# Altium project PCB_Project1.PrjPCB
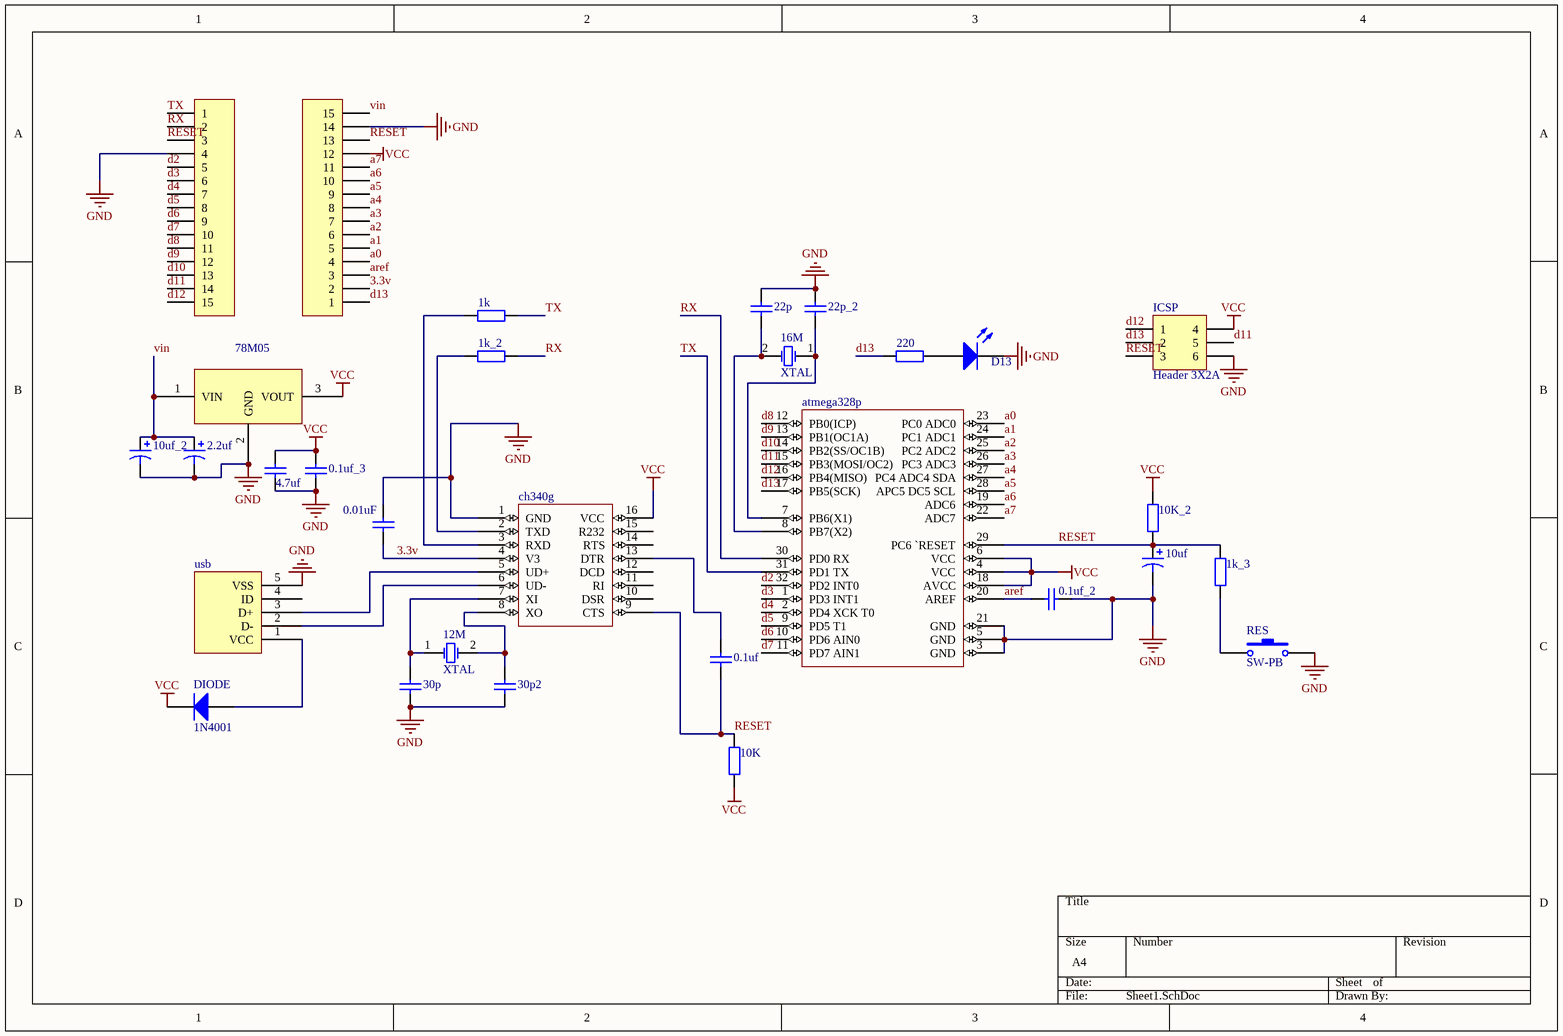
[diagram p0: Sheet1.SchDoc]
1 sheet, 30 parts. Net scope: global (net labels, ports and power ports of the same name join across sheets).
Board files: PCB1.PcbDoc, 拼板.PcbDoc

## Sheet Sheet1.SchDoc
size A4

### Parts
0.01uf  value 0.01uF  [C-RAD-0805]  (hidden comment: Cap)
0.1uf  Cap  [C-RAD-0805]  (value not drawn)
0.1uf_2  Cap  [C-RAD-0805]  (value not drawn)
0.1uf_3  Cap  [C-RAD-0805]  (value not drawn)
1k  Res2  [0805-2]  (value not drawn)
1k_2  Res2  [0805-2]  (value not drawn)
1k_3  Res2  [0805-2]  (value not drawn)
2.2uf  Cap Pol1  [C-RAD-0805]  (value not drawn)
4.7uf  Cap  [C-RAD-0805]  (value not drawn)
10K  Res2  [0805-2]  (value not drawn)
10K_2  Res2  [0805-2]  (value not drawn)
10uf  Cap Pol1  [C-RAD-0805]  (value not drawn)
10uf_2  Cap Pol1  [C-RAD-0805]  (value not drawn)
12M  XTAL  [XTAL]
16M  XTAL  [XTAL]
22p  Cap  [C-RAD-0805]  (value not drawn)
22p_2  Cap  [C-RAD-0805]  (value not drawn)
30p  Cap  [C-RAD-0805]  (value not drawn)
30p2  Cap  [C-RAD-0805]  (value not drawn)
220  Res2  [0805-2]  (value not drawn)
?  78M05  [TO-252]
atmega328p  atmega328p  [TQFP32]  (value not drawn)
ch340g  ch340g  [sop16(2003)]  (value not drawn)
D13  LED0  [LED_0805]  (value not drawn)
DIODE  Type: 1N4001  [DIODE-1206]  (hidden comment: Diode)
ICSP  Header 3X2A  [HDR2X3_CEN]
P1  Header 15  [HDR1X15]  (value not drawn)
P2  Header 15  [HDR1X15]  (value not drawn)
RES  SW-PB  [SW_PB2_A1]
usb  USB_M  [USB_MICRO]  (value not drawn)

### Nets
GND: 0.01uf.1 0.1uf_2.1 0.1uf_3.2 2.2uf.2 4.7uf.2 10uf.2 10uf_2.2 22p.2 22p_2.2 30p.1 30p2.1 ?.2(GND) atmega328p.3(GND) atmega328p.5(GND) atmega328p.21(GND) ch340g.1(GND) D13.2(K) ICSP.6 P1.4 P2.14 RES.2 usb.5(VSS)
VCC: 0.1uf_3.1 4.7uf.1 10K.1 10K_2.2 ?.3(VOUT) atmega328p.4(VCC) atmega328p.6(VCC) atmega328p.18(AVCC) ch340g.16(VCC) DIODE.2(K) ICSP.4 P2.12
3.3v: 0.01uf.2 ch340g.4(V3) P2.2
a0: atmega328p.23(PC0_ADC0) P2.4
a1: atmega328p.24(PC1_ADC1) P2.5
a2: atmega328p.25(PC2_ADC2) P2.6
a3: atmega328p.26(PC3_ADC3) P2.7
a4: atmega328p.27(PC4_ADC4_SDA) P2.8
a5: atmega328p.28(APC5_DC5_SCL) P2.9
a6: atmega328p.19(ADC6) P2.10
a7: atmega328p.22(ADC7) P2.11
aref: 0.1uf_2.2 atmega328p.20(AREF) P2.3
d2: atmega328p.32(PD2_INT0) P1.5
d3: atmega328p.1(PD3_INT1) P1.6
d4: atmega328p.2(PD4_XCK_T0) P1.7
d5: atmega328p.9(PD5_T1) P1.8
d6: atmega328p.10(PD6_AIN0) P1.9
d7: atmega328p.11(PD7_AIN1) P1.10
d8: atmega328p.12(PB0(ICP)) P1.11
d9: atmega328p.13(PB1(OC1A)) P1.12
d10: atmega328p.14(PB2(SS/OC1B)) P1.13
d11: atmega328p.15(PB3(MOSI/OC2)) ICSP.5 P1.14
d12: atmega328p.16(PB4(MISO)) ICSP.1 P1.15
d13: 220.2 atmega328p.17(PB5(SCK)) ICSP.2 P2.1
RESET: 0.1uf.1 1k_3.2 10K.2 10K_2.1 10uf.1 atmega328p.29(PC6_`RESET) ch340g.9(CTS) ICSP.3 P1.3 P2.13
RX: 1k_2.2 atmega328p.30(PD0_RX) P1.2
TX: 1k.2 atmega328p.31(PD1_TX) P1.1
vin: 2.2uf.1 10uf_2.1 ?.1(VIN) P2.15
Net0.1uf_2: 0.1uf.2 ch340g.13(DTR)
Net1k_1: 1k.1 ch340g.3(RXD)
Net1k_2_1: 1k_2.1 ch340g.2(TXD)
Net1k_3_1: 1k_3.1 RES.1
Net12M_1: 12M.1 30p.2 ch340g.7(XI)
Net12M_2: 12M.2 30p2.2 ch340g.8(XO)
Net16M_1: 16M.1 22p_2.1 atmega328p.7(PB6(X1))
Net16M_2: 16M.2 22p.1 atmega328p.8(PB7(X2))
Net220_1: 220.1 D13.1(A)
Netch340g_5: ch340g.5(UD+) usb.3(D+)
Netch340g_6: ch340g.6(UD-) usb.2(D-)
NetDIODE_1: DIODE.1(A) usb.1(VCC)

Not connected (* = marked no-connect by the designer): ch340g 10(DSR) 11(RI) 12(DCD) 14(RTS) 15(R232); usb 4(ID)

### Library data of the parts
0.01uf = Cap: Capacitor; Published: 8-Jun-2000; LatestRevisionDate: 17-Jul-2002; LatestRevisionNote: Re-released for DXP Platform.; PackageReference: RAD-0.3; Publisher: Altium Limited; PackageDescription: Radial Cap, Thru-Hole; 2 Leads; 0.3 in Pin Spacing
0.1uf 0.1uf_2 0.1uf_3 4.7uf = Cap: Capacitor; Value: 0.1uF; Published: 8-Jun-2000; LatestRevisionDate: 17-Jul-2002; LatestRevisionNote: Re-released for DXP Platform.; PackageReference: RAD-0.3; Publisher: Altium Limited; PackageDescription: Radial Cap, Thru-Hole; 2 Leads; 0.3 in Pin Spacing
1k 1k_2 = Res2: Resistor; Value: 1K; Published: 8-Jun-2000; LatestRevisionDate: 17-Jul-2002; LatestRevisionNote: Re-released for DXP Platform.; PackageReference: AXIAL-0.4; Publisher: Altium Limited; PackageDescription: Axial Device, Thru-Hole; 2 Leads; 0.4 in Pin Spacing
1k_3 10K 10K_2 220 = Res2: Resistor; Value: 10K; Published: 8-Jun-2000; LatestRevisionDate: 17-Jul-2002; LatestRevisionNote: Re-released for DXP Platform.; PackageReference: AXIAL-0.4; Publisher: Altium Limited; PackageDescription: Axial Device, Thru-Hole; 2 Leads; 0.4 in Pin Spacing
2.2uf 10uf_2 = Cap Pol1: Polarized Capacitor (Radial); Value: 10uF; Published: 8-Jun-2000; LatestRevisionDate: 17-Jul-2002; LatestRevisionNote: Re-released for DXP Platform.; PackageReference: RB7.6-15; Publisher: Altium Limited; PackageDescription: Polarized Capacitor (Radial); 2 Leads
10uf = Cap Pol1: Polarized Capacitor (Radial); Value: 1uF; Published: 8-Jun-2000; LatestRevisionDate: 17-Jul-2002; LatestRevisionNote: Re-released for DXP Platform.; PackageReference: RB7.6-15; Publisher: Altium Limited; PackageDescription: Polarized Capacitor (Radial); 2 Leads
22p 22p_2 30p 30p2 = Cap: Capacitor; Value: 0.01uF; Published: 8-Jun-2000; LatestRevisionDate: 17-Jul-2002; LatestRevisionNote: Re-released for DXP Platform.; PackageReference: RAD-0.3; Publisher: Altium Limited; PackageDescription: Radial Cap, Thru-Hole; 2 Leads; 0.3 in Pin Spacing
? = LM7805
D13 = LED0: 发光二极管; Published: 8-Jun-2000; LatestRevisionDate: 08-Jul-2005; LatestRevisionNote: Mech Layer 1 removed.; PackageReference: LED-0; Publisher: Altium Limited
DIODE = Diode: 二极管; Published: 8-Jun-2000; LatestRevisionDate: 17-Jul-2002; LatestRevisionNote: Re-released for DXP Platform.; PackageDocument: Sep-1996; PackageReference: SMC; Publisher: Altium Limited; Code_JEDEC: DO-214-AB
ICSP = Header 3X2A: Header, 3-Pin, Dual row; LatestRevisionDate: 17-Jul-2002; LatestRevisionNote: Re-released for DXP Platform.; Publisher: Altium Limited
P1 P2 = Header 15: Header, 15-Pin; LatestRevisionDate: 17-Jul-2002; LatestRevisionNote: Re-released for DXP Platform.; Publisher: Altium Limited
RES = SW-PB: 微动开关; Published: 24-Mar-1999; LatestRevisionDate: 17-Jul-2002; LatestRevisionNote: Re-released for DXP Platform.; PackageReference: SPST-2; Publisher: Altium Limited
usb = USB_M: MicroUSB接口